# Altium schematic sheet Armor_Plate.SchDoc
size 508 x 304 mm; Author: 向汝鑫; SheetNumber: 1; SheetTotal: 1
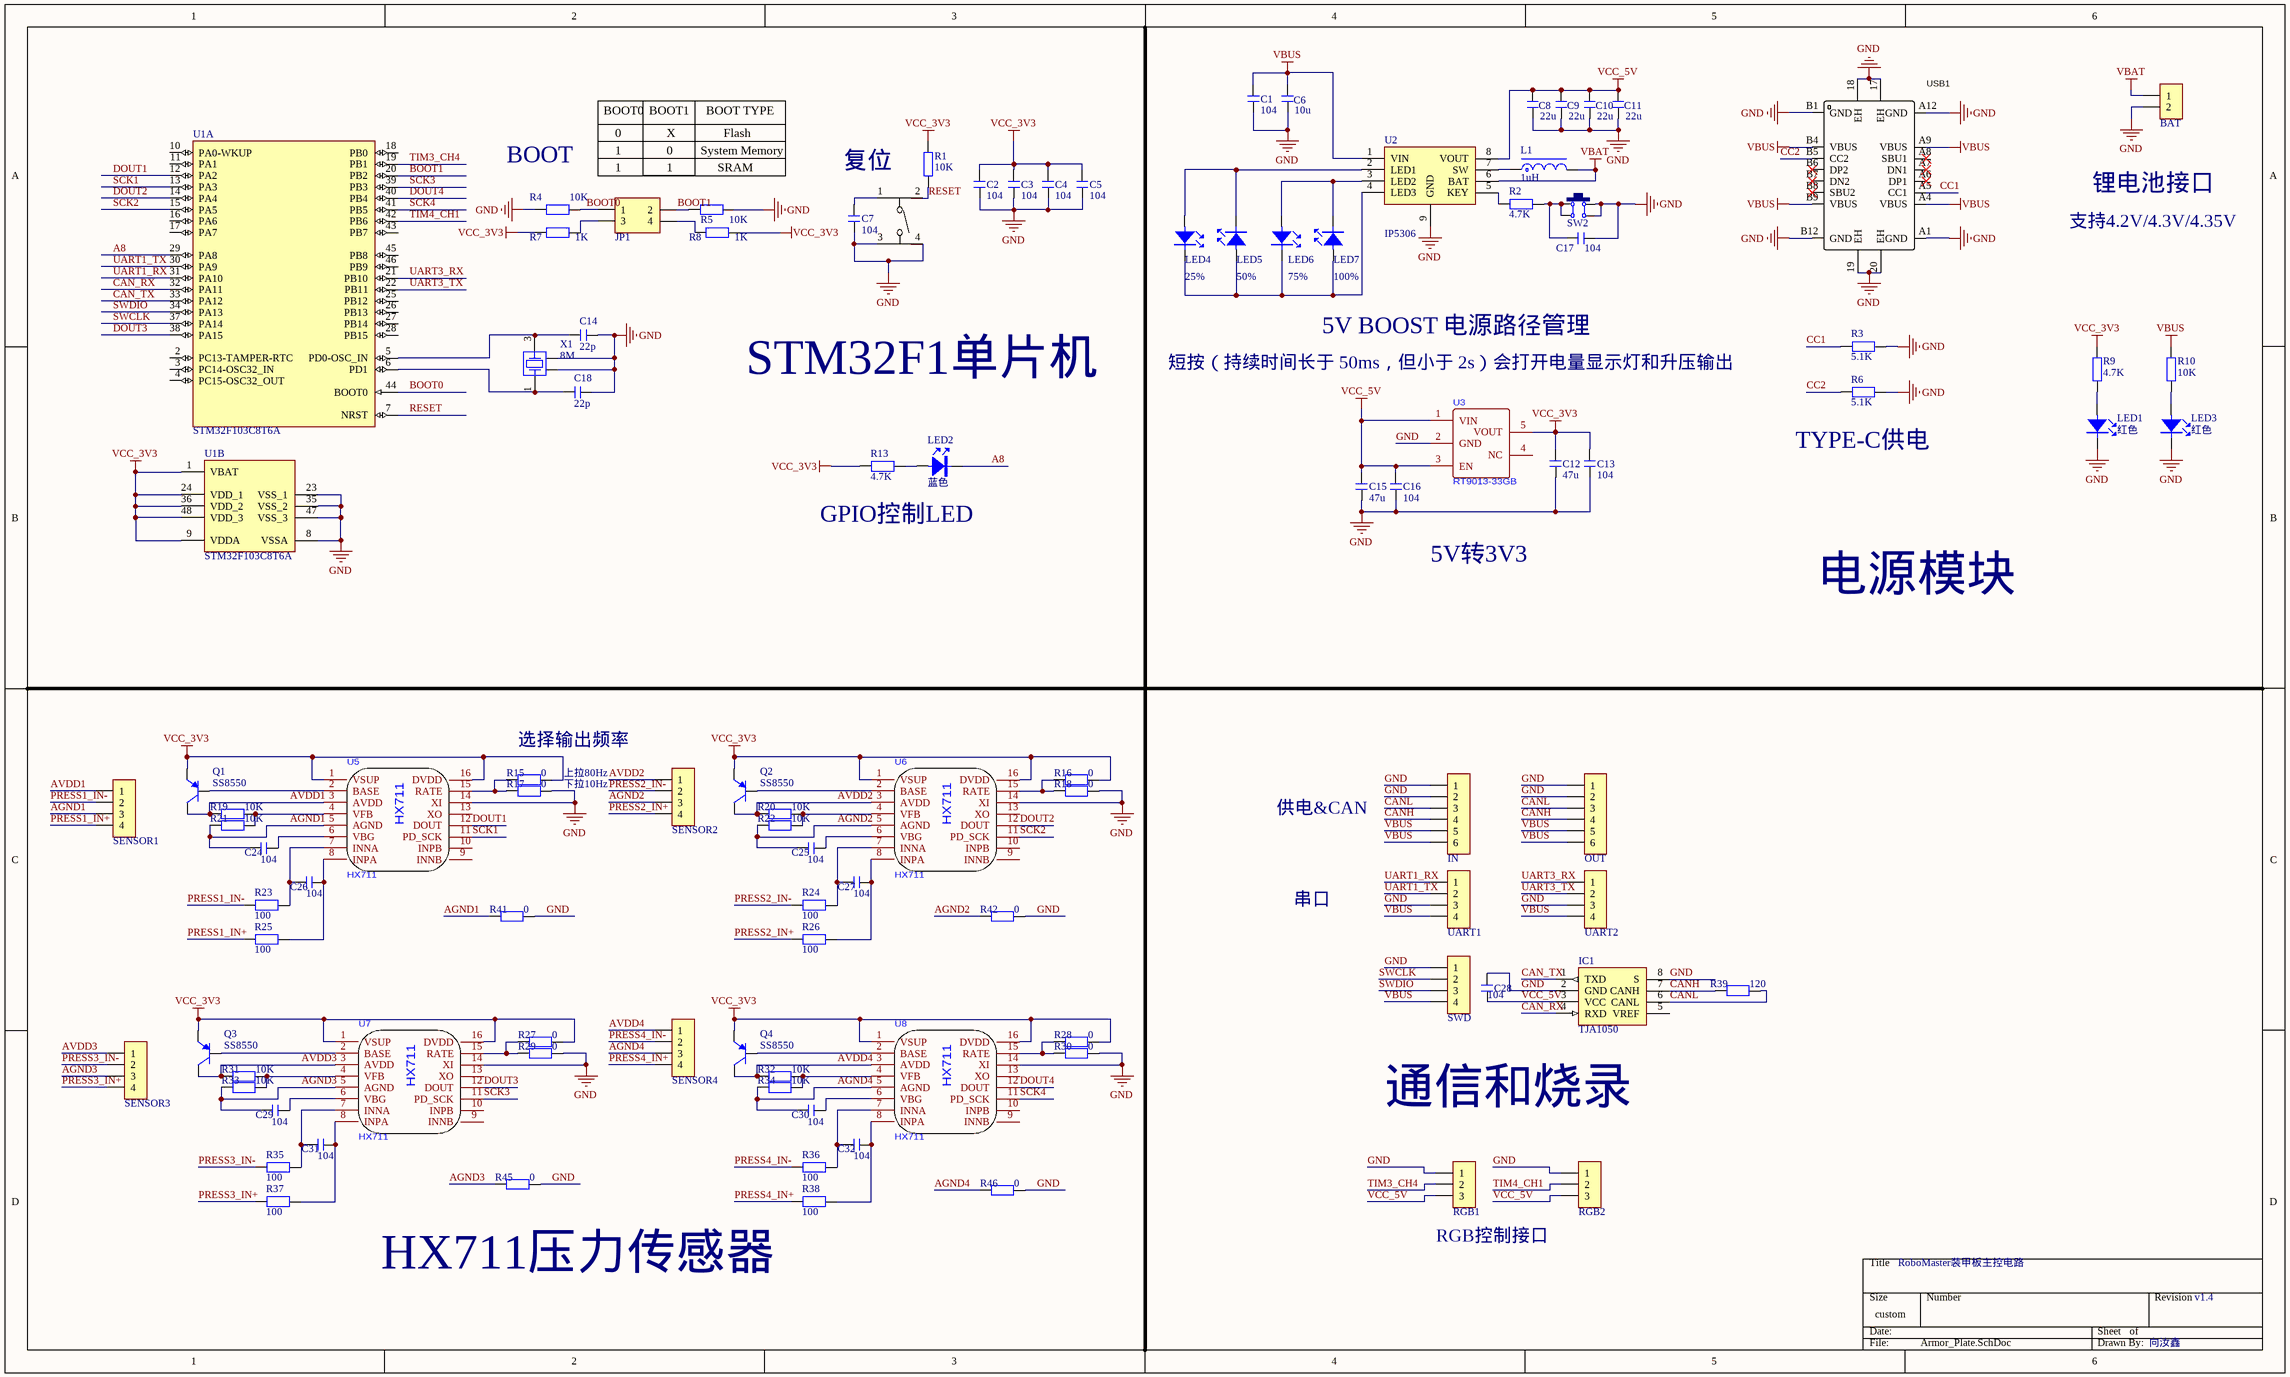
[diagram p0: Armor_Plate.SchDoc]

## Parts
BAT  HDR-1X2  [XH2.54-WS-2P]  (value not drawn)
C1  104  [C 0603_L]
C2  104  [C 0603_L]
C3  104  [C 0603_L]
C4  104  [C 0603_L]
C5  104  [C 0603_L]
C6  10u  [C 0603_L]
C7  104  [C 0603_L]
C8  22u  [C 0603_L]
C9  22u  [C 0603_L]
C10  22u  [C 0603_L]
C11  22u  [C 0603_L]
C12  47u  [C 0805_L]
C13  104  [C 0805_L]
C14  22p  [C 0603_L]
C15  47u  [C 0805_L]
C16  104  [C 0805_L]
C17  104  [C 0603_L]
C18  22p  [C 0603_L]
C24  104  [C 0603_L]
C25  104  [C 0603_L]
C26  104  [C 0603_L]
C27  104  [C 0603_L]
C28  104  [C 0603_L]
C29  104  [C 0603_L]
C30  104  [C 0603_L]
C31  104  [C 0603_L]
C32  104  [C 0603_L]
IC1  TJA1050  [SOP8_N]
IN  HDR-1X6  [GH1.25-WS-6P]  (value not drawn)
JP1  Header2X2  [HDR2.54-LI-2x2P]  (value not drawn)
L1  1uH  [CD31]
LED1  红色  [LED 0805R]
LED2  蓝色  [LED 0805B]
LED3  红色  [LED 0805R]
LED4  25%  [LED 0603G]
LED5  50%  [LED 0603G]
LED6  75%  [LED 0603G]
LED7  100%  [LED 0603G]
OUT  HDR-1X6  [GH1.25-WS-6P]  (value not drawn)
Q1  SS8550  [SOT23-3N]
Q2  SS8550  [SOT23-3N]
Q3  SS8550  [SOT23-3N]
Q4  SS8550  [SOT23-3N]
R1  10K  [R 0603_L]
R2  4.7K  [R 0603_L]
R3  5.1K  [R 0603_L]
R4  10K  [R 0603_L]
R5  10K  [R 0603_L]
R6  5.1K  [R 0603_L]
R7  1K  [R 0603_L]
R8  1K  [R 0603_L]
R9  4.7K  [R 0603_L]
R10  10K  [R 0603_L]
R13  4.7K  [R 0603_L]
R15  0  [R 0603_L]
R16  0  [R 0603_L]
R17  0  [R 0603_L]
R18  0  [R 0603_L]
R19  10K  [R 0603_L]
R20  10K  [R 0603_L]
R21  10K  [R 0603_L]
R22  10K  [R 0603_L]
R23  100  [R 0603_L]
R24  100  [R 0603_L]
R25  100  [R 0603_L]
R26  100  [R 0603_L]
R27  0  [R 0603_L]
R28  0  [R 0603_L]
R29  0  [R 0603_L]
R30  0  [R 0603_L]
R31  10K  [R 0603_L]
R32  10K  [R 0603_L]
R33  10K  [R 0603_L]
R34  10K  [R 0603_L]
R35  100  [R 0603_L]
R36  100  [R 0603_L]
R37  100  [R 0603_L]
R38  100  [R 0603_L]
R39  120  [R 0603_L]
R41  0  [R 0603_L]
R42  0  [R 0603_L]
R45  0  [R 0603_L]
R46  0  [R 0603_L]
RGB1  HDR-1X3  [GH1.25-WS-3P]  (value not drawn)
RGB2  HDR-1X3  [GH1.25-WS-3P]  (value not drawn)
SENSOR1  HDR-1X4  [GH1.25-WS-4P]  (value not drawn)
SENSOR2  HDR-1X4  [GH1.25-WS-4P]  (value not drawn)
SENSOR3  HDR-1X4  [GH1.25-WS-4P]  (value not drawn)
SENSOR4  HDR-1X4  [GH1.25-WS-4P]  (value not drawn)
SW1  ST-1188  [SW-SMD_4P-L4.2-W3.2-P2.15-LS5.2]  (value not drawn)
SW2  6x6x5  [TSW SMD-6*6*4.3]  (value not drawn)
SWD  HDR-1X4  [GH1.25-WS-4P]  (value not drawn)
U1  STM32F103C8T6A  [LQFP48 7X7_N]  (parts A,B of 2)
U2  IP5306  [SOP-8-EX]
U3  RT9013-33GB  [SOT-23-5_L3.0-W1.7-P0.95-LS2.8-BR]
U5  HX711  [SOP-16_L10.0-W3.9-P1.27-LS6.0-BL]
U6  HX711  [SOP-16_L10.0-W3.9-P1.27-LS6.0-BL]
U7  HX711  [SOP-16_L10.0-W3.9-P1.27-LS6.0-BL]
U8  HX711  [SOP-16_L10.0-W3.9-P1.27-LS6.0-BL]
UART1  HDR-1X4  [GH1.25-WS-4P]  (value not drawn)
UART2  HDR-1X4  [GH1.25-WS-4P]  (value not drawn)
USB1  (no value)  [USB-C-SMD_KH-TYPE-C-16P]
X1  8M  [OSC 3225-4P]

## Nets
GND: BAT.2 C1.1 C2.1 C3.1 C4.1 C5.1 C6.1 C7.1 C8.1 C9.1 C10.1 C11.1 C12.1 C13.1 C14.2 C15.1 C16.1 C17.1 C18.2 C28.2 IC1.2(GND) IC1.8(S) IN.1 IN.2 LED1.2(K) LED3.2(K) OUT.1 OUT.2 R3.1 R4.1 R5.2 R6.1 R17.2 R18.2 R29.2 R30.2 R41.2 R42.2 R45.2 R46.2 RGB1.1 RGB2.1 SW1.3 SW1.4 SW2.2 SW2.3 SWD.1 U1.8(VSSA) U1.23(VSS_1) U1.35(VSS_2) U1.47(VSS_3) U2.9(GND) U3.2(GND) U5.14(XI) U6.14(XI) U7.14(XI) U8.14(XI) UART1.3 UART2.3 USB1.17(EH) USB1.18(EH) USB1.19(EH) USB1.20(EH) USB1.A1(GND) USB1.A12(GND) USB1.B1(GND) USB1.B12(GND) X1.2 X1.4
VBAT: BAT.1 L1.2 U2.6(BAT)
VBUS: C1.2 C6.2 IN.5 IN.6 OUT.5 OUT.6 R10.2 SWD.4 U2.1(VIN) UART1.4 UART2.4 USB1.A4(VBUS) USB1.A9(VBUS) USB1.B4(VBUS) USB1.B9(VBUS)
VCC_3V3: C2.2 C3.2 C4.2 C5.2 C12.2 C13.2 Q1.2(E) Q2.2(E) Q3.2(E) Q4.2(E) R1.2 R7.1 R8.2 R9.2 R13.1 R15.2 R16.2 R27.2 R28.2 U1.1(VBAT) U1.9(VDDA) U1.24(VDD_1) U1.36(VDD_2) U1.48(VDD_3) U3.5(VOUT) U5.1(VSUP) U5.16(DVDD) U6.1(VSUP) U6.16(DVDD) U7.1(VSUP) U7.16(DVDD) U8.1(VSUP) U8.16(DVDD)
VCC_5V: C8.2 C9.2 C10.2 C11.2 C15.2 C16.2 C28.1 IC1.3(VCC) RGB1.3 RGB2.3 U2.8(VOUT) U3.1(VIN) U3.3(EN)
A8: LED2.2(K) U1.29(PA8)
AGND1: C24.2 R21.1 R41.1 SENSOR1.3 U5.5(AGND)
AGND2: C25.2 R22.1 R42.1 SENSOR2.3 U6.5(AGND)
AGND3: C29.2 R33.1 R45.1 SENSOR3.3 U7.5(AGND)
AGND4: C30.2 R34.1 R46.1 SENSOR4.3 U8.5(AGND)
AVDD1: Q1.3(C) R19.1 SENSOR1.1 U5.3(AVDD)
AVDD2: Q2.3(C) R20.1 SENSOR2.1 U6.3(AVDD)
AVDD3: Q3.3(C) R31.1 SENSOR3.1 U7.3(AVDD)
AVDD4: Q4.3(C) R32.1 SENSOR4.1 U8.3(AVDD)
BOOT0: JP1.1 R4.2 U1.44(BOOT0)
BOOT1: JP1.2 R5.1 U1.20(PB2)
CAN_RX: IC1.4(RXD) U1.32(PA11)
CAN_TX: IC1.1(TXD) U1.33(PA12)
CANH: IC1.7(CANH) IN.4 OUT.4 R39.1
CANL: IC1.6(CANL) IN.3 OUT.3 R39.2
CC1: R3.2 USB1.A5(CC1)
CC2: R6.2 USB1.B5(CC2)
DOUT1: U1.12(PA2) U5.12(DOUT)
DOUT2: U1.14(PA4) U6.12(DOUT)
DOUT3: U1.38(PA15) U7.12(DOUT)
DOUT4: U1.40(PB4) U8.12(DOUT)
PRESS1_IN+: R25.2 SENSOR1.4
PRESS1_IN-: R23.1 SENSOR1.2
PRESS2_IN+: R26.2 SENSOR2.4
PRESS2_IN-: R24.1 SENSOR2.2
PRESS3_IN+: R37.2 SENSOR3.4
PRESS3_IN-: R35.1 SENSOR3.2
PRESS4_IN+: R38.2 SENSOR4.4
PRESS4_IN-: R36.1 SENSOR4.2
RESET: R1.1 SW1.2 U1.7(NRST)
SCK1: U1.13(PA3) U5.11(PD_SCK)
SCK2: U1.15(PA5) U6.11(PD_SCK)
SCK3: U1.39(PB3) U7.11(PD_SCK)
SCK4: U1.41(PB5) U8.11(PD_SCK)
SWCLK: SWD.2 U1.37(PA14)
SWDIO: SWD.3 U1.34(PA13)
TIM3_CH4: RGB1.2 U1.19(PB1)
TIM4_CH1: RGB2.2 U1.42(PB6)
UART1_RX: U1.31(PA10) UART1.1
UART1_TX: U1.30(PA9) UART1.2
UART3_RX: U1.21(PB10) UART2.1
UART3_TX: U1.22(PB11) UART2.2
NetC7_2: C7.2 SW1.1
NetC14_1: C14.1 U1.5(PD0-OSC_IN) X1.3
NetC17_2: C17.2 R2.1 SW2.1 SW2.4
NetC18_1: C18.1 U1.6(PD1) X1.1
NetC24_1: C24.1 U5.6(VBG)
NetC25_1: C25.1 U6.6(VBG)
NetC26_1: C26.1 R25.1 U5.8(INPA)
NetC26_2: C26.2 R23.2 U5.7(INNA)
NetC27_1: C27.1 R26.1 U6.8(INPA)
NetC27_2: C27.2 R24.2 U6.7(INNA)
NetC29_1: C29.1 U7.6(VBG)
NetC30_1: C30.1 U8.6(VBG)
NetC31_1: C31.1 R37.1 U7.8(INPA)
NetC31_2: C31.2 R35.2 U7.7(INNA)
NetC32_1: C32.1 R38.1 U8.8(INPA)
NetC32_2: C32.2 R36.2 U8.7(INNA)
NetJP1_3: JP1.3 R7.2
NetJP1_4: JP1.4 R8.1
NetL1_1: L1.1 U2.7(SW)
NetLED1_1: LED1.1(A) R9.1
NetLED2_1: LED2.1(A) R13.2
NetLED3_1: LED3.1(A) R10.1
NetLED4_1: LED4.1(A) LED5.2(K) U2.2(LED1)
NetLED4_2: LED4.2(K) LED5.1(A) LED6.2(K) LED7.1(A) U2.4(LED3)
NetLED6_1: LED6.1(A) LED7.2(K) U2.3(LED2)
NetQ1_1: Q1.1(B) U5.2(BASE)
NetQ2_1: Q2.1(B) U6.2(BASE)
NetQ3_1: Q3.1(B) U7.2(BASE)
NetQ4_1: Q4.1(B) U8.2(BASE)
NetR2_2: R2.2 U2.5(KEY)
NetR15_1: R15.1 R17.1 U5.15(RATE)
NetR16_1: R16.1 R18.1 U6.15(RATE)
NetR19_2: R19.2 R21.2 U5.4(VFB)
NetR20_2: R20.2 R22.2 U6.4(VFB)
NetR27_1: R27.1 R29.1 U7.15(RATE)
NetR28_1: R28.1 R30.1 U8.15(RATE)
NetR31_2: R31.2 R33.2 U7.4(VFB)
NetR32_2: R32.2 R34.2 U8.4(VFB)

Not connected (* = marked no-connect by the designer): IC1 5(VREF); U1 2(PC13-TAMPER-RTC) 3(PC14-OSC32_IN) 4(PC15-OSC32_OUT) 10(PA0-WKUP) 11(PA1) 16(PA6) 17(PA7) 18(PB0) 25(PB12) 26(PB13) 27(PB14) 28(PB15) 43(PB7) 45(PB8) 46(PB9); U3 4(NC); U5 9(INNB) 10(INPB) 13(XO); U6 9(INNB) 10(INPB) 13(XO); U7 9(INNB) 10(INPB) 13(XO); U8 9(INNB) 10(INPB) 13(XO); USB1 A6(DP1)* A7(DN1)* A8(SBU1)* B6(DP2)* B7(DN2)* B8(SBU2)*

## Notes on the sheet
- BOOT0
- 0
- BOOT1
- X
- BOOT TYPE
- Flash
- BOOT
- 1
- (near JP1) 1
- System Memory
- (near R5) SRAM
- 复位
- 锂电池接口
- 支持4.2V/4.3V/4.35V
- 短按（持续时间长于 50ms，但小于 2s）会打开电量显示灯和升压输出
- 5V BOOST 电源路径管理
- STM32F1单片机
- (near R6) TYPE-C供电
- GPIO控制LED
- 5V转3V3
- 电源模块
- 选择输出频率
- 上拉80Hz
- 下拉10Hz
- 供电&CAN
- 串口
- 通信和烧录
- (near R45) HX711压力传感器
- (near RGB1) RGB控制接口
- RoboMaster装甲板主控电路
- v1.4
- 向汝鑫

## Library data of the parts
BAT = Header 2: 2P接插件; 淘宝ID: 小糖豆的小窝窝; BOM名称: 2P接插件; 下单链接: https://item.taobao.com/item.htm?ft=t&id=613637044352
C1-C18 C24-C32 = C: 贴片电容; 淘宝ID: 小糖豆的小窝窝; BOM名称: 贴片电容; 下单链接: https://item.taobao.com/item.htm?ft=t&id=613637044352
IC1 = TJA1050: CAN总线收发芯片; 淘宝ID: 小糖豆的小窝窝; BOM名称: CAN总线收发芯片; Alias1: https://item.taobao.com/item.htm?ft=t&id=613637044352
IN OUT = Header 6: 6P接插件; 淘宝ID: 小糖豆的小窝窝; BOM名称: 6P接插件; 下单链接: https://item.taobao.com/item.htm?ft=t&id=613637044352
JP1 = Header 2X2: 2*2P接插件; 淘宝ID: 小糖豆的小窝窝; BOM名称: 2*2P接插件; 下单链接: https://item.taobao.com/item.htm?ft=t&id=613637044352
L1 = L-SMD: CD系列贴片线绕功率电感; 淘宝ID: 小糖豆的小窝窝; BOM名称: CD系列贴片线绕功率电感; 下单链接: https://item.taobao.com/item.htm?ft=t&id=613637044352
LED1-LED7 = LED-SMD: 贴片LED; 淘宝ID: 小糖豆的小窝窝; BOM名称: 贴片LED; 下单链接: https://item.taobao.com/item.htm?ft=t&id=613637044352
Q1-Q4 = 8550-SMD: 高频放大-PNP型; 淘宝ID: 小糖豆的小窝窝; BOM名称: 高频放大-PNP型; 下单链接: https://item.taobao.com/item.htm?ft=t&id=613637044352
R1-R10 R13 R15-R39 R41 R42 R45 R46 = R: 贴片电阻; 淘宝ID: 小糖豆的小窝窝; BOM名称: 贴片电阻; 下单链接: https://item.taobao.com/item.htm?ft=t&id=613637044352
RGB1 RGB2 = Header 3: 3P接插件; 淘宝ID: 小糖豆的小窝窝; BOM名称: 3P接插件; 下单链接: https://item.taobao.com/item.htm?ft=t&id=613637044352
SENSOR1-SENSOR4 SWD UART1 UART2 = Header 4: 4P接插件; 淘宝ID: 小糖豆的小窝窝; BOM名称: 4P接插件; 下单链接: https://item.taobao.com/item.htm?ft=t&id=613637044352
SW1 = SW-SMD_4P-L4.2-W3.2-P2.15-LS5.2: Manufacturer: RISHENG(日昇); Add into BOM: yes; Contact Current: 50mA; Voltage Rating (DC): 12V; Insulation Resistance: 100MΩ; Circuit: 单刀单掷; Actuator Style: 椭圆形按钮; Actuator/Cap Color: 白色; Operating Force: 250gf@±50gf; Mechanical Life: 100000; Pin Style: SMD接片; Switch Length: 4.2mm; Switch Width: 3.4mm; Switch Height: 2.5mm; Strike Gundam: 否; Name: ST-1188; Symbol: ST-1188; Device: ST-1188; LCSC Part Name: 轻触开关四脚正按; Supplier Part: C589212; Manufacturer Part: ST-1188; Supplier Footprint: SMD; JLCPCB Part Class: Extended Part; Datasheet: https://atta.szlcsc.com/upload/public/pdf/source/20200922/C589212_9D19074D50EA2FDC5769A293FA310A99.pdf; Supplier: LCSC; Convert to PCB: yes; Mounting Style: 立贴; Operating Temperature: -20℃~+85℃
SW2 = TSW SMD-6x6: 贴片6x6轻触开关; 淘宝ID: 小糖豆的小窝窝; BOM名称: 贴片6x6轻触开关; 下单链接: https://item.taobao.com/item.htm?ft=t&id=613637044352
U1 = STM32F103C8T6: STM32 ARM-based 32-bit MCU Performance Line with 64 kB Flash, 20 kB Internal RAM, -40 to +85癈 Temperature, 48-Pin LQFP, Tray; BOM名称: STM32F103C8T6A
U2 = IP5306: 移动电源IC
USB1 = TYPE-C-16M-005: USB; BOM_Manufacturer: USAKRO(美韩); Contributor: LCSC; BOM_Supplier: LCSC; BOM_Supplier Part: C2798173; BOM_Manufacturer Part: TYPE-C-16M-005; spicePre: U; spiceSymbolName: TYPE-C-16M-005
X1 = XTAL-4P: 4脚无源晶振; 淘宝ID: 小糖豆的小窝窝; BOM名称: 4脚无源晶振; 下单链接: https://item.taobao.com/item.htm?ft=t&id=613637044352